# EAGLE design LPC_ERT_30_v3.51_RE (EAGLE 6.5.0)
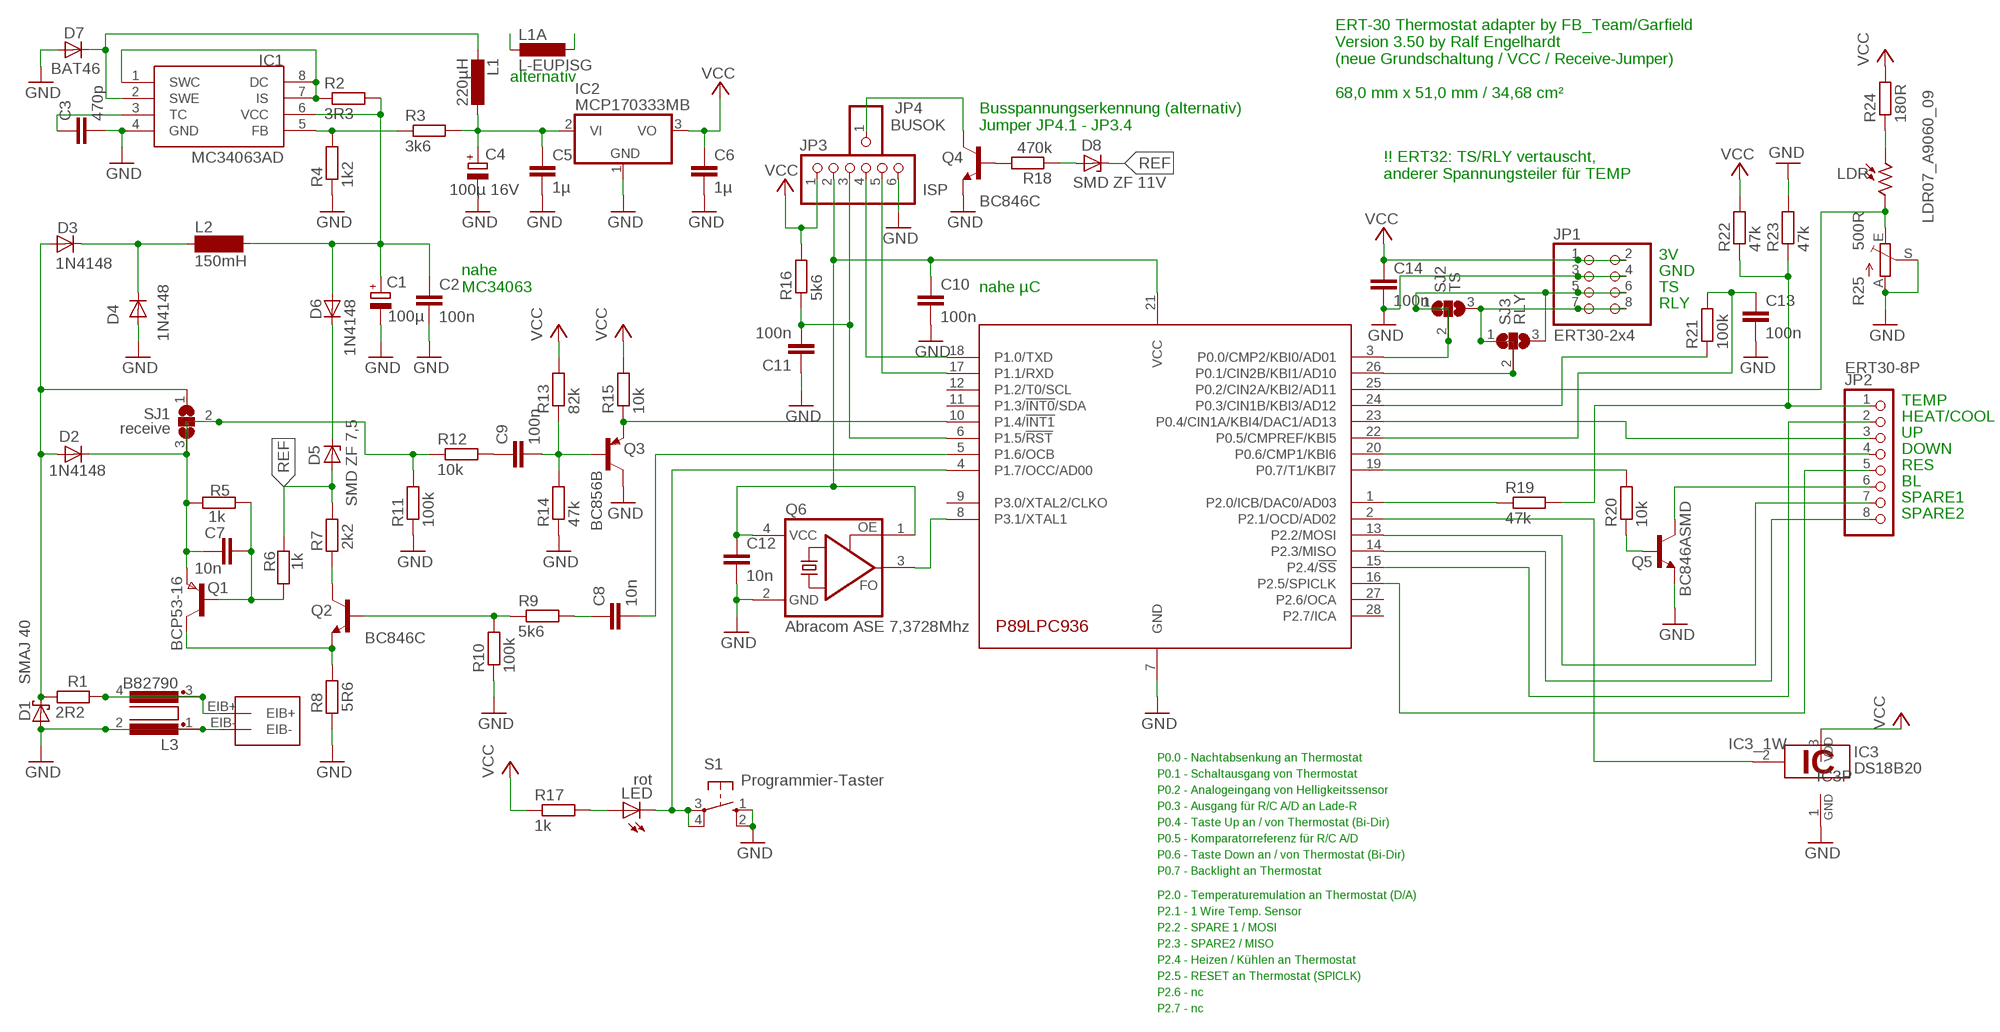
[diagram p0: schematic, sheet 1]

## Parts
C1  100µ  CPOL-EU153CLV-0605  [153CLV-0605]
C2  100n  C-EUC1206  [C1206]
C3  470p  C-EUC1206  [C1206]
C4  100µ 16V  CPOL-EU153CLV-0605  [153CLV-0605]
C5  1µ  C-EUC1206  [C1206]
C6  1µ  C-EUC1206  [C1206]
C7  10n  C-EUC1206  [C1206]
C8  10n  C-EUC1206  [C1206]
C9  100n  C-EUC1206  [C1206]
C10  100n  C-EUC1206  [C1206]
C11  100n  C-EUC1206  [C1206]
C12  10n  C-EUC1206  [C1206]
C13  100n  C-EUC1206  [C1206]
C14  100n  C-EUC1206  [C1206]
D1  SMAJ 40  MBRS130LT3  [SMB]
D2  1N4148  DIODE-MINIMELF  [MINIMELF]
D3  1N4148  DIODE-MINIMELF  [MINIMELF]
D4  1N4148  DIODE-MINIMELF  [MINIMELF]
D5  SMD ZF 7,5  ZENER-DIODESMD_ZF_XX  [MINIMELF]
D6  1N4148  DIODE-MINIMELF  [MINIMELF]
D7  BAT46  DIODE-MINIMELF  [MINIMELF]
D8  SMD ZF 11V  ZENER-DIODESMD_ZF_XX  [MINIMELF]
IC1  MC34063AD  [SOIC8]
IC2  MCP170333MB  [SOT89]
IC3  DS18B20  [TO92-]
JP1  ERT30-2x4  PINHD-2X4  [2X04]
JP2  ERT30-8P  PS-HEADER-8GERADE  [PS-G-8]
JP3  ISP  PINHD-1X6SELFBUS  [1X06_SELFBUS]
JP4  BUSOK  PINHD-1X1SELFBUS  [1X01_SELFBUS]
L1  220µH  L-EUPIS24XX  [PIS24XX]
L1A  L-EUPISG  [PISG]
L2  150mH  SD12-1000  [SD12_1000]
L3  B82790  [B82790]
LDR  LDR07_A9060_09  LDR07  [A90XX]
LED  rot  LEDCHIPLED_1206  [CHIPLED_1206]
LPC  P98LPC936 TSOP28  P89LPC936_SMDTSSOP28  [TSSOP28]
Q1  BCP53-16  PNPSOT223  [SOT223]
Q2  BC846C  BC846  [SOT23]
Q3  BC856B  BC856B-PNP-SOT23-BEC  [SOT23-BEC]
Q4  BC846C  BC846  [SOT23]
Q5  BC846ASMD  [SOT23]
Q6  Abracom ASE 7,3728Mhz  ASFASFL3  [ASFL3]
R1  2R2  R-EU_R1206  [R1206]
R2  3R3  R-EU_R1206  [R1206]
R3  3k6  R-EU_R1206  [R1206]
R4  1k2  R-EU_R1206  [R1206]
R5  1k  R-EU_R1206  [R1206]
R6  1k  R-EU_R1206  [R1206]
R7  2k2  R-EU_R1206  [R1206]
R8  5R6  R-EU_R1206  [R1206]
R9  5k6  R-EU_R1206  [R1206]
R10  100k  R-EU_R1206  [R1206]
R11  100k  R-EU_R1206  [R1206]
R12  10k  R-EU_R1206  [R1206]
R13  82k  R-EU_R1206  [R1206]
R14  47k  R-EU_R1206  [R1206]
R15  10k  R-EU_R1206  [R1206]
R16  5k6  R-EU_R1206  [R1206]
R17  1k  R-EU_R1206  [R1206]
R18  470k  R-EU_R1206  [R1206]
R19  47k  R-EU_R1206  [R1206]
R20  10k  R-EU_R1206  [R1206]
R21  100k  R-EU_R1206  [R1206]
R22  47k  R-EU_R1206  [R1206]
R23  47k  R-EU_R1206  [R1206]
R24  180R  R-EU_R1206  [R1206]
R25  500R  TRIM_EU-CA6H  [CA6H]
S1  Programmier-Taster  10-XX  [B3F-10XX]
SJ1  receive  SJ2W  [SJ_2]
SJ2  TS  SJ2W  [SJ_2]
SJ3  RLY  SJ2W  [SJ_2]
U$5  EIB-CON  [EIB-CON]

## Nets
+5V [supply]: C4.+ C5.1 IC2.2(VI) IC2.2@1(VI1) L1.2 L1A.2 R3.2
/RST: C11.2 JP3.3 LPC.6(P1.5/!RST) R16.1
AD0.3_TEMP: LPC.1(P2.0/ICB/DAC0/AD03) R19.1
AD11_LDR: LDR.P$2 LPC.25(P0.2/CIN2A/KBI2/AD11) R25.E
AD12: LPC.24(P0.3/CIN1B/KBI3/AD12) R21.1
BUS_OK: JP4.1 Q4.3(C)
CLK: LPC.8(P3.1/XTAL1) Q6.3(FO)
CMP_REF: C13.1 LPC.22(P0.5/CMPREF/KBI5) R21.2
EIB+ [supply]: D1.C D2.A D3.A R1.2 SJ1.1
GND [supply]: C1.- C2.2 C3.2 C4.- C5.2 C6.2 C10.2 C11.1 C12.2 C13.2 C14.2 D1.A D4.A D7.A IC1.4(GND) IC2.1(GND) IC3.1 JP1.3 JP1.4 JP3.6 L3.1 L3.2 LPC.7(GND) Q3.C Q4.2(E) Q5.2(E) Q6.2(GND) R4.1 R8.1 R10.1 R11.1 R14.1 R23.2 R25.A R25.S S1.1(S) S1.2(S1) U$5.EIB-
N$1 [supply]: C7.2 D2.C Q1.3(E) R5.2 R11.2 R12.1 SJ1.2 SJ1.3
N$2: C9.2 Q3.B R13.1 R14.2
N$4: Q4.1(B) R18.2
N$6 [supply]: Q2.3(C) R7.1
N$8 [supply]: D3.C D4.C L2.1
N$10: D8.A R18.1
N$12 [supply]: C7.1 Q1.1(B) R5.1 R6.2
N$14 [supply]: Q1.2(C) Q1.4(C) Q2.2(E) R8.2
N$18: C9.1 R12.2
N$20: Q5.1(B) R20.1
N$24: JP2.6 Q5.3(C)
N$31: Q2.1(B) R9.1 R10.2
N$32: LDR.P$1 R24.1
N$34: C8.1 R9.2
N$39: L3.3 L3.4 R1.1 U$5.EIB+
N$40: D5.C D6.C
N$41: LED.A R17.2
N$46: JP2.1 R19.2 R22.1 R23.1
P0.0_TS: JP1.5 JP1.6 LPC.3(P0.0/CMP2/KBI0/AD01) SJ2.1 SJ2.2 SJ3.3
P0.1_RLY: JP1.7 JP1.8 LPC.26(P0.1/CIN2B/KBI1/AD10) SJ2.3 SJ3.1 SJ3.2
P0.4_UP: JP2.3 LPC.23(P0.4/CIN1A/KBI4/DAC1/AD13)
P0.6_DOWN: JP2.4 LPC.20(P0.6/CMP1/KBI6)
P0.7_BL: LPC.19(P0.7/T1/KBI7) R20.2
P1.4_REC: LPC.10(P1.4/!INT1) Q3.E R15.1
P1.6_SENT: C8.2 LPC.5(P1.6/OCB)
P1.7_PROG: LED.C LPC.4(P1.7/OCC/AD00) S1.3(P) S1.4(P1)
P2.1_DS1820_1W1W: IC3.2 LPC.2(P2.1/OCD/AD02)
P2.2_SPARE1: JP2.7 LPC.13(P2.2/MOSI)
P2.3_SPARE2: JP2.8 LPC.14(P2.3/MISO)
P2.4_HEAT_COOL: JP2.2 LPC.15(P2.4/!SS)
P2.5_RST_ERT: JP2.5 LPC.16(P2.5/SPICLK)
Q6: C10.1 C12.1 JP3.2 LPC.21(VCC) Q6.1(OE) Q6.4(VCC)
REF: D5.A D8.C R6.1 R7.2
REF1.25V: IC1.5(FB) R3.1 R4.2
RXD: JP3.5 LPC.17(P1.1/RXD)
SWC_DC_IS: IC1.1(SWC) IC1.7(IS) IC1.8(DC) R2.1
SWE: D7.C IC1.2(SWE) L1.1 L1A.1
TC: C3.1 IC1.3(TC)
TXD: JP3.4 LPC.18(P1.0/TXD)
U_BUS [supply]: C1.+ C2.1 D6.A IC1.6(VCC) L2.2 R2.2
VCC [supply]: C6.1 C14.1 IC2.3(VO) IC3.3 JP1.1 JP1.2 JP3.1 R13.2 R15.2 R16.2 R17.1 R22.2 R24.2
Unconnected: LPC.9(P3.0/XTAL2/CLKO) LPC.11(P1.3/!INT0!/SDA) LPC.12(P1.2/T0/SCL) LPC.27(P2.6/OCA) LPC.28(P2.7/ICA)

## Notes on the sheet
- alternativ
- ERT-30 Thermostat adapter by FB_Team/Garfield
  Version 3.50 by Ralf Engelhardt 
  (neue Grundschaltung / VCC / Receive-Jumper)
  
  68,0 mm x 51,0 mm / 34,68 cm²
- Busspannungserkennung (alternativ)
  Jumper JP4.1 - JP3.4
- !! ERT32: TS/RLY vertauscht, 
  anderer Spannungsteiler für TEMP
- 3V
- GND
- nahe
  MC34063
- nahe µC | TS
- RLY
- TEMP
- HEAT/COOL
- UP
- DOWN
- RES
- BL
- SPARE1
- SPARE2
- P0.0 - Nachtabsenkung an Thermostat
- P0.1 - Schaltausgang von Thermostat
- P0.2 - Analogeingang von Helligkeitssensor
- P0.3 - Ausgang für R/C A/D an Lade-R
- P0.4 - Taste Up an / von Thermostat (Bi-Dir)
- P0.5 - Komparatorreferenz für R/C A/D
- P0.6 - Taste Down an / von Thermostat (Bi-Dir)
- P0.7 - Backlight an Thermostat
- P2.0 - Temperaturemulation an Thermostat (D/A)
- P2.1 - 1 Wire Temp. Sensor
- P2.2 - SPARE 1 / MOSI
- P2.3 - SPARE2 / MISO
- P2.4 - Heizen / Kühlen an Thermostat
- P2.5 - RESET an Thermostat (SPICLK)
- P2.6 - nc
- P2.7 - nc

## Library data of the parts
C1 C4 = rcl:CPOL-EU: POLARIZED CAPACITOR, European symbol
C2 C3 C5-C14 = rcl:C-EU: CAPACITOR, European symbol
D1 = diode:MBRS130LT3: Schottky Power Rectifier Source: http://www.onsemi.com/pub/Collateral/MBRS130LT3-D.PDF
D2-D4 D6 D7 = diode:DIODE-: DIODE
D5 D8 = diode:ZENER-DIODE: Z-Diode
IC1 = mc34063:MC34063
IC2 = linear:MCP1703*: 250 mA, 16V, Low Quiescent Current LDO Regulator Source: http://ww1.microchip.com/downloads/en/DeviceDoc/22049b.pdf
IC3 = 1wire:DS18B20: Programmable Resolution Digital Thermometer This chip provides a onewire thermosensor with approx. 0.5°C accuracy. A programmable over/undertemperure alarm is available. The precision can be set from 9..12 bits. Notes: Vdd must be applied for accurate measurements at low temperatures, as the parasite power circuit otherwise heats the sensor. If parasite power is used, Vdd has to be connected to GND. The DS1822 is a low-cost thermometer chip, the DS18S20 is similar to the DS18B20, but with 9 Bit precision only. Author: Jan Kandziora <jjj@gmx.de>
JP1 = pinhead:PINHD-2X4: PIN HEADER
JP2 = con-pss-pinhead:PS-HEADER-8: JAE-Electronics IL-G Series Connector IL-G-8P-S3T2 Reichelt PS 25/8G BR Digi-Key 670-2555-ND
JP3 = pinhead:PINHD-1X6: PIN HEADER
JP4 = pinhead:PINHD-1X1: PIN HEADER
L1 L1A = Inductor-Fastron:L-EU
L2 = inductor-neosid:SD12: INDUCTOR nominal inductance; OC_FARNELL: unknown; OC_NEWARK: unknown
L3 = Ralf1:B82790: Epcos B82790 Gleichtaktfilter 5µH (C502) - 4,7mH (C475)
LDR = photo-elements:LDR07: Photo Sensor LDR 03, LDR 05, LDR 07, A9060 xx, A9050 xx
LED = led:LED: LED OSRAM: - CHIPLED LG R971, LG N971, LY N971, LG Q971, LY Q971, LO R971, LY R971 LH N974, LH R974 LS Q976, LO Q976, LY Q976 LO Q996 - Hyper CHIPLED LW Q18S LB Q993, LB Q99A, LB R99A - SideLED LS A670, LO A670, LY A670, LG A670, LP A670 LB A673, LV A673, LT A673, LW A673 LH A674 LY A675 LS A676, LA A676, LO A676, LY A676, LW A676 LS A679, LY A679, LG A679 - Hyper Micro SIDELED® LS Y876, LA Y876, LO Y876, LY Y876 LT Y87S - SmartLED LW L88C, LW L88S LB L89C, LB L89S, LG L890 LS L89K, LO L89K, LY L89K LS L896, LA L896, LO L896, LY L896 - TOPLED LS T670, LO T670, LY T670, LG T670, LP T670 LSG T670, LSP T670, LSY T670, LOP T670, LYG T670 LG T671, LOG T671, LSG T671 LB T673, LV T673, LT T673, LW T673 LH T674 LS T676, LA T676, LO T676, LY T676, LB T676, LH T676, LSB T676, LW T676 LB T67C, LV T67C, LT T67C, LS T67K, LO T67K, LY T67K, LW E67C LS E67B, LA E67B, LO E67B, LY E67B, LB E67C, LV E67C, LT E67C LW T67C LS T679, LY T679, LG T679 LS T770, LO T770, LY T770, LG T770, LP T770 LB T773, LV T773, LT T773, LW T773 LH T774 LS E675, LA E675, LY E675, LS T675 LS T776, LA T776, LO T776, LY T776, LB T776 LHGB T686 LT T68C, LB T68C - Hyper Mini TOPLED® LB M676 - Mini TOPLED Santana® LG M470 LS M47K, LO M47K, LY M47K Source: http://www.osram.convergy.de LUXEON: - LUMILED® LXK2-PW12-R00, LXK2-PW12-S00, LXK2-PW14-U00, LXK2-PW14-V00 LXK2-PM12-R00, LXK2-PM12-S00, LXK2-PM14-U00 LXK2-PE12-Q00, LXK2-PE12-R00, LXK2-PE12-S00, LXK2-PE14-T00, LXK2-PE14-U00 LXK2-PB12-K00, LXK2-PB12-L00, LXK2-PB12-M00, LXK2-PB14-N00, LXK2-PB14-P00, LXK2-PB14-Q00 LXK2-PR12-L00, LXK2-PR12-M00, LXK2-PR14-Q00, LXK2-PR14-R00 LXK2-PD12-Q00, LXK2-PD12-R00, LXK2-PD12-S00 LXK2-PH12-R00, LXK2-PH12-S00 LXK2-PL12-P00, LXK2-PL12-Q00, LXK2-PL12-R00 Source: www.luxeon.com KINGBRIGHT: KA-3528ASYC Source: www.kingbright.com
LPC = P98LPC936_RE:P89LPC936_SMD
Q1 = zetex:PNPSOT223: PNP TRANSISTOR; MPN: DJT4030P-13; OC_FARNELL: 1710675; OC_NEWARK: 25R4489
Q2 Q4 = transistor-neu-to92:BC846: NPN TRANSISTOR
Q3 = transistor-neu-to92:*-PNP-: PNP Transistror
Q5 = transistor-npn:BC846*: NPN Transistor
Q6 = crystal:ASF*: CRYSTAL CLOCK OSCILLATORS 5.0 Vdc or 3.3 Vdc - LOW PROFILE ULTRA MINIATURE CERAMIC SURFACE MOUNT Source: http://www.abracon.com/Oscillators/asf1-L-L1.pdf
R1-R24 = rcl:R-EU_: RESISTOR, European symbol
R25 = pot:TRIM_EU-: POTENTIOMETER
S1 = switch-omron:10-XX: OMRON SWITCH; MPN: B3F-1000; OC_FARNELL: 176432; OC_NEWARK: 36M3542
SJ1-SJ3 = jumper:SJ2W: SMD solder JUMPER
U$5 = EIBdevices:EIB-CON

## Board
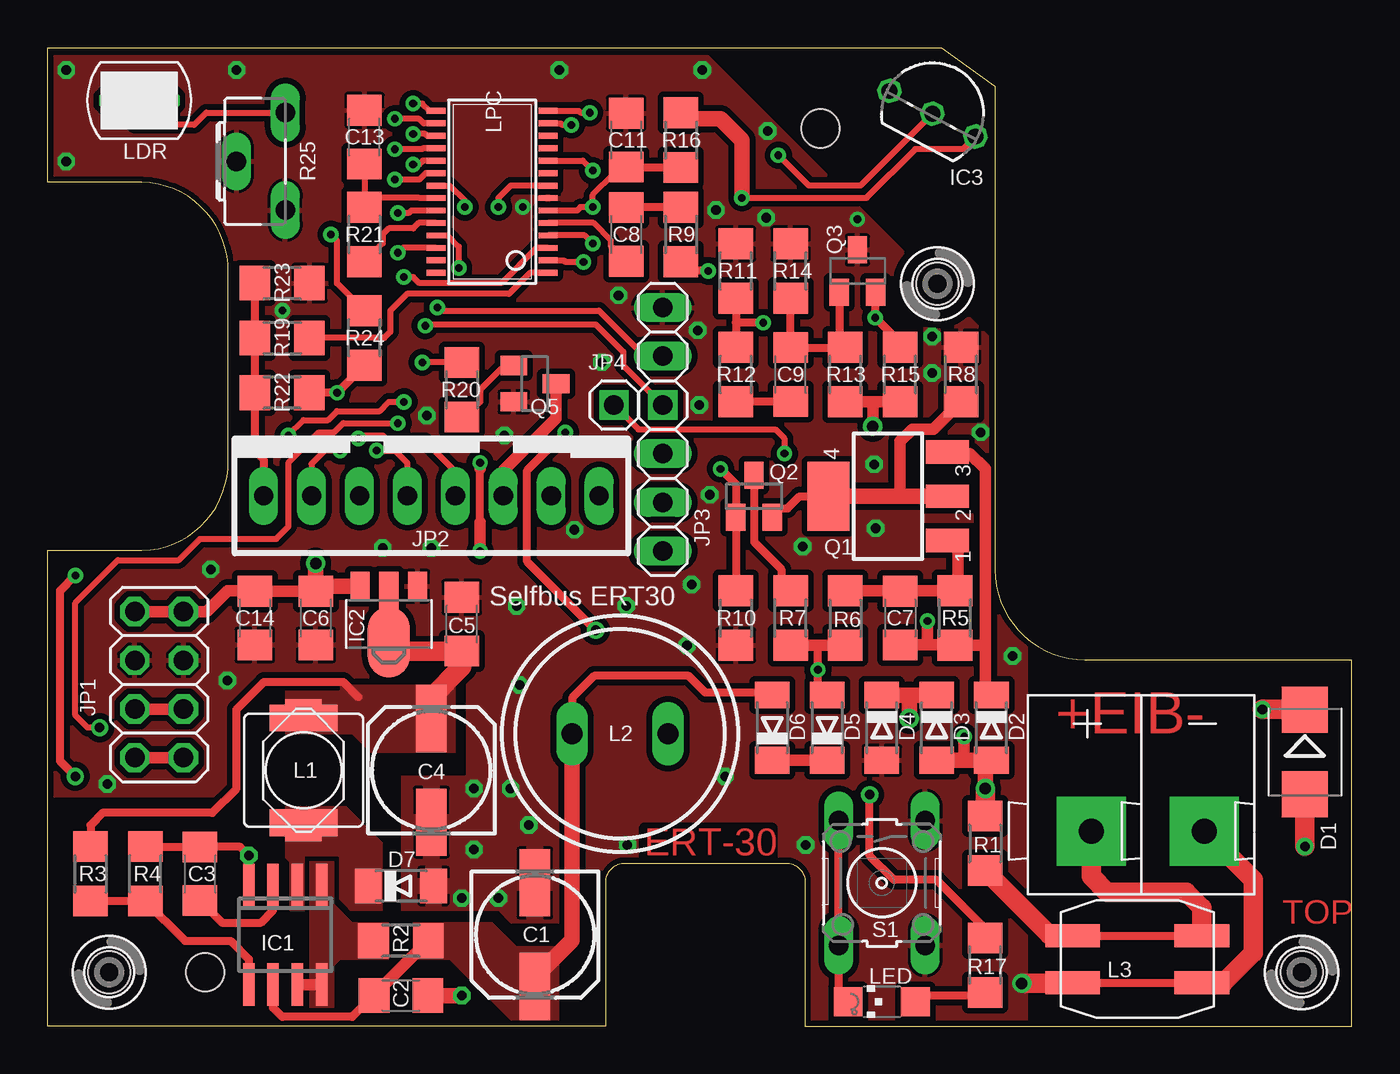
[diagram p1: board, top side]
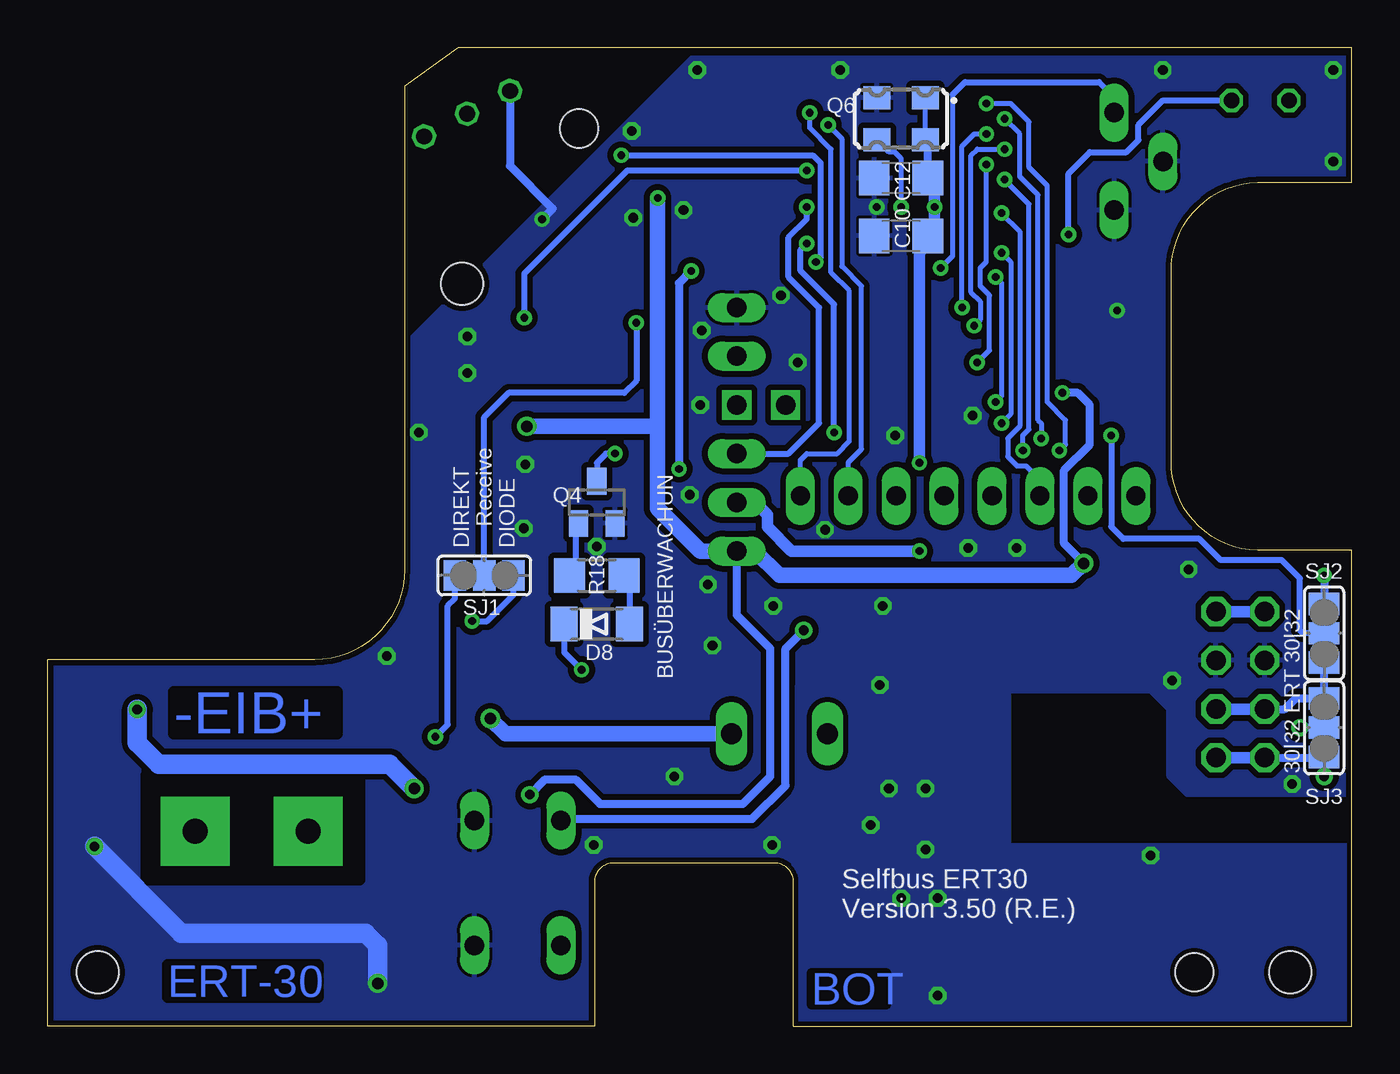
[diagram p2: board, bottom side, seen from below]

Size 68 x 51 mm. Coordinates in mm from the lower left corner, seen from the top.
Outline: 0,23.81 0,23.81
Outline: 29.1,0 29.1,7.5 arc-90 30.1,8.5 38.5,8.5 arc-90 39.5,7.5 39.5,0 68,0 68,19.1 54.1,19.1 arc-90 49.4,23.8 49.4,49 46.6,51 0,51 0,44 4.9,44 arc-90 9.4,39.3 9.4,29.5 arc-90 4.9,24.8 0,24.8 0,0 29.1,0
Copper layers (1*16): Top 0.035mm / dielectric 1.5mm / Bottom 0.035mm
Design rules "platinensammler_02 *": minimum track width 0.15mm, minimum drill 0.3mm, track to track 0.15mm, track to pad 0.15mm, pad to pad 0.15mm, via to via 0.15mm, smd to smd 0mil, copper to edge 0.2mm, drill to drill 0.2mm, minimum pad ring 0.2mm, minimum via ring 0.2mm, stop-mask expansion 4mil, vias tented up to drill 0.8mm, thermal gap 0.15mm
Holes 2 mm at 8.2,2.8 40.3,46.8
tRestrict: 4 lines
bRestrict: area 51.8,7.6 to 62.9,13.1; 5 lines

### Footprints (pad centres in the part's own frame; a part is rotated, then mirrored left to right if it is on the bottom)
153CLV-0605 = smd 3.5 x 1.6: + 2.7,0; - -2.7,0
C1206 = smd 1.6 x 1.8: 1 -1.4,0; 2 1.4,0
SMB = smd 2.4 x 2.4: A 2.2,0; C -2.2,0
MINIMELF = smd 1.4 x 1.8: A 1.7,0; C -1.7,0
SOIC8 = smd 0.6 x 2.2: 1 -1.905,-2.6; 2 -0.635,-2.6; 3 0.635,-2.6; 4 1.905,-2.6; 5 1.905,2.6; 6 0.635,2.6; 7 -0.635,2.6; 8 -1.905,2.6
SOT89 = smd 1 x 1.5: 1 -1.499,-1.981; 3 1.499,-1.981 | smd 1 x 2: 2 0,-1.727 | smd 2.2 x 3.7: 2@1 0,0.94
TO92- = drill 0.813 octagon: 1 -2.54,0; 2 0,0; 3 2.54,0
2X04 = drill 1.016 octagon: 1 -3.81,-1.27; 2 -3.81,1.27; 3 -1.27,-1.27; 4 -1.27,1.27; 5 1.27,-1.27; 6 1.27,1.27; 7 3.81,-1.27; 8 3.81,1.27
PS-G-8 = drill 1 long: 1 0.02,8.75; 2 0.02,6.25; 3 0.02,3.75; 4 0.02,1.25; 5 0.02,-1.25; 6 0.02,-3.75; 7 0.02,-6.25; 8 0.02,-8.75
1X06_SELFBUS = drill 1.016 long: 1 -6.35,0; 2 -3.81,0; 3 -1.27,0; 5 3.81,0; 6 6.35,0 | drill 1.016 square: 4 1.27,0
1X01_SELFBUS = drill 1.016 square: 1 0,0
PIS24XX = smd 1.4 x 1.9: 1 -3,0; 2 3,0
PISG = smd 1.4 x 3.56: 1 -2.73,0; 2 2.73,0
SD12_1000 = drill 1.1 long: 1 -2.5,0; 2 2.5,0
B82790 = smd 2.85 x 1.2: 1 -3.675,1.225; 2 3.062,1.225; 3 -3.675,-1.225; 4 3.062,-1.225
A90XX = drill 0.8 octagon: P$1 -1.5,0; P$2 1.5,0
CHIPLED_1206 = smd 1.5 x 1.5: A 0,-1.75; C 0,1.75
TSSOP28 = smd 0.305 x 0.991: 1 -4.225,-2.918; 2 -3.575,-2.918; 3 -2.925,-2.918; 4 -2.275,-2.918; 5 -1.625,-2.918; 6 -0.975,-2.918; 7 -0.325,-2.918; 8 0.325,-2.918; 9 0.975,-2.918; 10 1.625,-2.918; 11 2.275,-2.918; 12 2.925,-2.918; 13 3.575,-2.918; 14 4.225,-2.918; 15 4.225,2.918; 16 3.575,2.918; 17 2.925,2.918; 18 2.275,2.918; 19 1.625,2.918; 20 0.975,2.918; 21 0.325,2.918; 22 -0.325,2.918; 23 -0.975,2.918; 24 -1.625,2.918; 25 -2.275,2.918; 26 -2.925,2.918; 27 -3.575,2.918; 28 -4.225,2.918
SOT223 = smd 1.219 x 2.235: 1 -2.311,-3.099; 2 0,-3.099; 3 2.311,-3.099 | smd 3.6 x 2.2: 4 0,3.099
SOT23 = smd 1 x 1.4: 1 -0.95,-1.1; 2 0.95,-1.1; 3 0,1.1
SOT23-BEC = smd 1 x 1.4: B -0.95,-1.1; C 0,1.1; E 0.95,-1.1
ASFL3 = smd 1.4 x 1.2: 1 -1.27,-1.1; 2 1.27,-1.1; 3 1.27,1.1; 4 -1.27,1.1
R1206 = smd 1.6 x 1.803: 1 -1.422,0; 2 1.422,0
CA6H = drill 1.016 long: A -2.54,0; E 2.54,0; S 0,2.54
B3F-10XX = drill 1.016 long: 1 -3.251,2.261; 2 3.251,2.261; 3 -3.251,-2.261; 4 3.251,-2.261
SJ_2 = smd 1.168 x 1.6: 1 -1.524,0; 2 0,0; 3 1.524,0
2,2 = hole 2.2: 0,0
EIB-CON = drill 1.3 pad 3.6 square: EIB+ -5.9,0; EIB- 0,0

### Placement (x,y rotation side)
C1  25.4,4.76 270 top
C2  18.41,1.59 0 top
C3  7.94,7.94 90 top
C4  20,13.34 90 top
C5  21.59,20.95 90 top
C6  13.97,21.27 270 top
C7  44.45,21.27 270 top
C8  30.16,41.27 270 top
C9  38.73,33.97 90 top
C10  23.5,41.2 180 bottom
C11  30.16,46.2 270 top
C12  23.5,44.21 180 bottom
C13  16.51,46.35 90 top
C14  10.79,21.27 270 top
D1  65.56,14.29 270 top
D2  49.21,15.56 270 top
D3  46.35,15.56 270 top
D4  43.5,15.56 270 top
D5  40.64,15.56 90 top
D6  37.78,15.56 90 top
D7  18.41,7.3 0 top
D8  39.37,20.95 0 bottom
IC1  12.38,4.76 180 top
IC2  17.78,20.95 180 top
IC3  46.14,47.57 332 top
JP1  5.8,17.8 270 top
JP2  20,27.62 90 top
JP3  32.07,31.11 90 top
JP4  29.53,32.38 0 top
L1  13.34,13.34 90 top
L1A  13.34,13.34 90 top
L2  29.84,15.24 180 top
L3  56.52,3.49 180 top
LDR  4.76,48.26 180 top
LED  43.5,1.27 90 top
LPC  23.18,43.5 90 top
Q1  43.81,27.62 90 top
Q2  36.83,27.62 0 top
Q3  42.23,39.37 0 top
Q4  39.37,27.3 0 bottom
Q5  25.4,33.5 270 top
Q6  23.5,47.31 180 bottom
R1  48.9,9.53 90 top
R2  18.41,4.45 0 top
R3  2.22,7.94 90 top
R4  5.08,7.94 270 top
R5  47.31,21.27 270 top
R6  41.59,21.27 90 top
R7  38.73,21.27 270 top
R8  47.62,33.97 270 top
R9  33.02,41.27 90 top
R10  35.88,21.27 90 top
R11  35.88,39.37 270 top
R12  35.88,33.97 270 top
R13  41.59,33.97 270 top
R14  38.73,39.37 270 top
R15  44.45,33.97 270 top
R16  33.02,46.2 90 top
R17  48.9,3.17 270 top
R18  39.37,23.5 180 bottom
R19  12.22,35.88 180 top
R20  21.59,33.18 90 top
R21  16.51,41.27 90 top
R22  12.22,33.02 0 top
R23  12.22,38.73 0 top
R24  16.51,35.88 270 top
R25  12.38,45.09 90 top
S1  43.5,7.46 270 top
SJ1  45.24,23.5 0 bottom
SJ2  1.43,20.48 90 bottom
SJ3  1.43,15.56 90 bottom
U$2  [2,2]  65.4,2.8 0 top
U$5  60.33,10.16 0 top
U$9  [2,2]  46.4,38.7 0 top
U$10  [2,2]  3.2,2.8 0 top

### Tracks (layer width: path | path; a pad name or v marks a point on that pad's centre or on a via)
+5V
  Top 0.406: R3.2 2.22,10.48 2.86,11.11 8.57,11.11 9.84,12.38 9.84,16.51 11.27,17.94 15.4,17.94 16.19,17.14 | IC2.2 IC2.2@1
  Top 0.813: C4.+ 20,17.14 | 18.24,19.55 IC2.2@1
  Top 1.016: 20,17.14 21.59,18.73 C5.1 18.24,19.55
  pour Top (isolate 0.254, rank 2, no thermals): 21.27,17.78 15.24,17.78 15.24,17.46 12.38,17.46 12.38,15.24 15.88,15.24 16.83,14.29 21.27,14.29
/RST  (via drill 0.4)
  Top 0.254: 29.53,44.45 29.82,44.45 C11.2
  Top 0.305: LPC.6 27.6,42.52 27.78,42.7 v28.42,42.7 28.42,43.34 29.53,44.45
  Top 0.406: C11.2 30.18,44.77 R16.1
  Bottom 0.305: JP3.3 29.37,29.84 27.78,31.43 27.78,37.47 29.37,39.05 29.37,41.12 28.42,42.07 v28.42,42.7
AD0.3_TEMP
  Top 0.305: LPC.1 25.14,39.27 24.05,38.18 18.73,38.18 17.86,37.31 17.86,36.2 17.54,35.88 R19.1
AD11_LDR  (via drill 0.4)
  Top 0.305: LPC.25 20.85,41.22 21.43,40.64 v21.43,39.53 | R25.E 8.26,47.62 7.62,46.99 4.53,46.99 LDR.P$2
  Bottom 0.254: v21.43,39.53 20.8,40.16 20.8,48.58
  Bottom 0.305: 20.8,48.58 20.16,49.21 13.18,49.21 12.38,48.42 R25.E
AD12
  Top 0.305: R21.1 17.46,40.81 17.46,41.27 17.78,41.59 19.05,41.59 19.33,41.87 LPC.24
BUS_OK  (via drill 0.4)
  Top 0.305: JP4.1 30.8,31.11 37.94,31.11 38.42,30.64 v38.42,29.84
  Bottom 0.305: v38.42,29.84 38.89,29.84 39.37,29.37 Q4.3
CLK  (via drill 0.4)
  Top 0.305: LPC.8 24.14,43.82 23.5,43.18 v23.5,42.7
  Bottom 0.254: v23.5,42.7 23.5,45.24 23.81,45.56 24.13,45.56 24.73,46.16
  Bottom 0.406: 24.73,46.16 24.73,46.17 Q6.3
CMP_REF
  Top 0.254: 16.99,43.18 R21.2 | 19.38,43.17 19.37,43.18
  Top 0.305: C13.1 R21.2 | LPC.22 19.38,43.17 | 19.37,43.18 16.99,43.18
EIB+  (via drill 0.4, 0.5, 0.6)
  Top 0.61: v47.78,15.08 47.78,13.86
  Top 0.813: D3.A 47.78,13.86 D2.A 48.9,13.86 v48.9,12.38
  Top 1.016: D1.C 65.54,16.51 v63.34,16.51 | R1.2 v48.9,12.38
  Bottom 0.305: v47.78,15.08 47.15,15.72 47.15,21.91 46.77,22.29 SJ1.1
  Bottom 1.016: v63.34,16.51 63.34,14.76 62.23,13.65 50.16,13.65 v48.9,12.38
GND  (via drill 0.4, 0.5, 0.6)
  Top 0.406: L3.2 L3.1 | IC1.4 v10.48,8.89 10.03,9.34 C3.2 5.1,9.34 R4.1
  Top 0.813: C2.2 v21.59,1.59
  Top 1.016: D1.A | v65.56,9.37 D1.A | L3.1 61.32,2.27 62.87,3.81 62.87,7.62 U$5.EIB- | L3.2 53.41,2.22 v50.8,2.22
  Bottom 0.406: IC3.1 43.9,44.85 41.67,42.62 v42.23,42.07
  Bottom 1.016: v65.56,9.37 61.04,4.84 51.44,4.84 50.8,4.21 v50.8,2.22
  other vias: 22.23,12.38 22.23,9.21 21.59,6.67 24.13,12.38 23.5,6.67 25.08,10.48 12.22,37.31 24.77,42.7 35.32,13.02 33.34,19.84 24.61,17.78 30.23,9.45 30.16,21.91 24.45,21.91 8.49,23.81 9.37,18.02 3.1,12.62 17.46,24.92 20,24.92 27.46,25.88 33.58,23.02 43.18,25.96 43.1,29.29 34.53,27.7 33.97,32.38 28.89,34.61 19.76,31.83 23.81,30.8 29.77,38.1 33.89,36.27 34.85,42.55 37.47,42.15 37.54,46.67 34.13,49.85 26.67,49.85 9.84,49.85 0.95,49.85 0.95,45.09 39.53,9.45 39.37,25 50.32,19.29 46.12,34.05 46.12,35.96 48.66,30.96
  pour Bottom (isolate 0.305, rank 4): 0,12.06 8.57,12.06 9.53,13.02 9.53,16.51 10.48,17.46 29.21,17.46 29.21,8.26 39.37,8.26 39.37,0 68.6,0 68.6,19.1 54.4,19.1 49.4,24.1 49.4,35.5 34.4,50.5 0,50.5
  pour Top (isolate 0.305, rank 5): 0,12.06 9.21,12.06 9.84,12.7 9.84,16.67 11.43,18.26 21.91,18.26 21.91,9.21 23.5,8.26 39.37,8.26 39.37,0 51,0 51,22.46 49.4,24.1 49.4,35.5 34.4,50.5 0,50.5
  pour Top (isolate 0.254): 18.41,13.02 18.41,6.03 23.5,6.03 24.13,5.4 26.67,5.4 26.67,10.79 24.45,13.02
  pour Bottom (isolate 0.254, no thermals): 0,0 0,9.53 17.78,9.53 17.78,17.78 29.21,17.78 29.21,0
  pour Top (no thermals): 24.84,7.06 24.21,7.06 24.21,7.86 24.84,7.86
  pour Top (no thermals): 26.51,7.06 25.88,7.06 25.88,7.86 26.51,7.86
  pour Top (no thermals): 25.8,9.68 25.8,9.05 25,9.05 25,9.68
  pour Top (no thermals): 25.8,6.07 25.8,5.44 25,5.44 25,6.07
  pour Top (no thermals): 20.4,12.86 20.4,12.22 19.61,12.22 19.61,12.86
  pour Top (no thermals): 20.4,9.21 20.4,8.57 19.61,8.57 19.61,9.21
  pour Top (no thermals): 18.89,11.03 19.53,11.03 19.53,10.24 18.89,10.24
  pour Top (no thermals): 20.48,11.03 21.11,11.03 21.11,10.24 20.48,10.24
  pour Top (no thermals): 19.01,7.7 19.65,7.7 19.65,6.91 19.01,6.91
  pour Top (no thermals): 20.56,7.7 21.19,7.7 21.19,6.91 20.56,6.91
  pour Top (no thermals): 19.72,7.86 19.72,8.49 20.52,8.49 20.52,7.86
  pour Top (no thermals): 19.72,6.11 19.72,6.75 20.52,6.75 20.52,6.11
N$1  (via drill 0.4)
  Top 0.406: R11.2 35.88,36.67 | 35.88,36.67 R12.1 | v37.31,36.67 35.88,36.67
  Top 0.61: Q1.3 47,29.84 48.1,29.84 48.9,29.05 48.9,20 | 48.9,20 48.9,17.57 D2.C | C7.2 45.88,19.87 | 45.88,19.87 47.28,19.87 R5.2 48.74,19.85 48.9,20 | v45.88,21.11 45.88,19.87
  Bottom 0.305: v37.31,36.67 37.31,33.66 37.94,33.02 43.97,33.02 45.24,31.75 SJ1.2 SJ1.3 43.72,22.48 45.09,21.11 v45.88,21.11
N$2
  Top 0.406: R14.2 C9.2 41.57,35.37 R13.1 41.28,35.71 Q3.B
N$4
  Bottom 0.305: Q4.1 40.48,26.04 40.48,24.13 40.79,23.82 R18.2
N$6
  Top 0.406: Q2.3 36.83,25.24 38.26,23.81 38.26,23.02 38.58,22.7 R7.1
N$8  (via drill 0.6)
  Top 0.813: v44.93,16.03 44.93,17.26 | D4.C 44.93,17.26 | 44.93,17.26 D3.C
  Bottom 0.813: L2.1 44.13,15.24 v44.93,16.03
N$10
  Bottom 0.305: R18.1 37.67,23.22 D8.A
N$12
  Top 0.61: Q1.1 47.08,25.31 47.47,24.92 47.47,22.85 R5.1 44.47,22.7 C7.1 44.43,22.7 R6.2
N$14
  Top 0.406: Q2.2 38.24,26.99 38.58,26.99 39.21,27.62 Q1.4
  Top 0.61: R8.2 46.19,31.11 45.09,31.11 44.45,30.48 44.45,27.78 44.29,27.62
  Top 0.813: Q1.4 44.29,27.62 Q1.2
N$18
  Top 0.406: R12.2 35.9,32.57 C9.1
N$20
  Top 0.305: Q5.1 24.14,34.29 23.65,34.29 22.54,33.18 22.54,32.55 21.75,31.76 R20.1
N$24
  Top 0.61: JP2.6 23.75,28.95 26.5,31.7 Q5.3
N$31  (via drill 0.4)
  Top 0.406: R10.2 Q2.1 35.88,28.25 v35.08,29.05 | v34.45,39.37 33.5,39.37 R9.1
  Bottom 0.406: v34.45,39.37 35.08,38.73 v35.08,29.05
N$32  (via drill 0.4)
  Top 0.305: R24.1 15.08,38.73 15.08,40.96 v14.76,41.27
  Bottom 0.305: v14.76,41.27 14.76,44.45 13.65,45.56 11.75,45.56 11.11,46.2 11.11,46.99 9.84,48.26 LDR.P$1
N$34
  Top 0.406: R9.2 30.18,42.7 C8.1
N$39
  Top 0.406: L3.4 L3.3
  Top 1.016: U$5.EIB+ 54.42,7.8 55.24,6.99 59.37,6.99 60.19,6.17 L3.3 | L3.4 53.41,4.76 52.23,4.76 R1.1
N$40
  Top 0.61: D6.C D5.C
N$41
  Top 0.406: R17.2 48.73,1.59 45.56,1.59 LED.A
N$46
  Top 0.406: JP2.1 11.25,29.55 10.8,30 R22.1 R19.2 R23.1
P0.0_TS  (via drill 0.4)
  Top 0.305: LPC.3 25.49,40.57 23.65,38.73 19.37,38.73 19.05,39.05 v18.57,39.05 | v12.54,30.8 13.34,31.59 14.61,31.59 15.08,32.07 17.3,32.07 17.78,32.54 v18.57,32.54
  Top 0.61: JP1.5 JP1.6
  Bottom 0.254: v18.57,39.05 18.26,38.73 18.26,32.86 v18.57,32.54
  Bottom 0.305: v12.54,30.8 12.54,26.04 11.91,25.4 7.94,25.4 6.83,24.29 3.65,24.29 2.7,23.34 2.7,20.64 2.54,20.48 SJ2.2 SJ2.1
  Bottom 0.406: SJ2.1 SJ3.3 2.92,17.08 3.47,16.53 JP1.5
  Bottom 0.61: JP1.5 JP1.6
P0.1_RLY  (via drill 0.4, 0.5)
  Top 0.305: LPC.26 18.51,40.57 v18.26,40.32 | v18.26,31.43 15.4,31.43 14.92,30.96 14.13,30.96 12.54,29.37 12.54,26.04 11.91,25.4 7.94,25.4 6.83,24.29 3.65,24.29 1.43,22.07 1.43,16.19 2.06,15.56 v2.7,15.56
  Top 0.406: v1.43,13.02 0.64,13.81 0.64,22.7 v1.43,23.5
  Top 0.61: JP1.7 JP1.8
  Bottom 0.254: v18.26,40.32 17.78,39.85 17.78,31.91 v18.26,31.43
  Bottom 0.305: v1.43,13.02 SJ3.1 SJ3.2
  Bottom 0.406: v1.43,23.5 SJ2.3 | SJ3.2 v2.7,15.56 | JP1.7 1.47,13.99 SJ3.1
  Bottom 0.61: JP1.7 JP1.8
P0.4_UP  (via drill 0.4)
  Top 0.305: LPC.23 18.95,42.52 18.81,42.39 v18.26,42.39
  Bottom 0.254: v18.26,42.39 17.3,41.43 17.3,31.27 17.94,30.64 17.94,29.69 17.46,29.21 16.99,29.21 16.25,28.48 JP2.3
P0.6_DOWN  (via drill 0.4)
  Top 0.305: LPC.20 19.71,44.47 19.37,44.13 v18.1,44.13 | v17.14,30 18.1,30 18.75,29.35 JP2.4
  Bottom 0.254: v17.14,30 17.14,30.8 16.83,31.11 16.83,42.86 v18.1,44.13
P0.7_BL  (via drill 0.4)
  Top 0.305: LPC.19 19.56,45.12 19.37,44.93 v19.05,44.93 | R20.2 v19.53,34.6
  Bottom 0.254: v19.05,44.93 19.05,39.85 19.37,39.53 19.37,38.58 18.89,38.1 18.89,35.24 v19.53,34.6
P1.4_REC  (via drill 0.4)
  Top 0.305: LPC.10 27.9,45.12 v28.42,44.61
  Top 0.406: R15.1 44.3,35.4 43.97,35.72 43.97,36.11 v43.16,36.93 43.16,38.25 Q3.E
  Bottom 0.305: v28.42,44.61 37.78,44.61 43.16,39.23 v43.16,36.93
P1.6_SENT
  Top 0.305: C8.2 29.37,40.67 29.37,40.96 28.45,41.87 LPC.5
P1.7_PROG  (via drill 0.4, 0.5)
  Top 0.305: v28.42,40.8 27.99,41.22 LPC.4
  Top 0.406: S1.3 S1.4 41.24,1.78 LED.C | v28.57,20.64 25,24.21 25,28.97 v26.99,30.96
  Bottom 0.305: v26.99,30.96 26.99,37.62 28.73,39.37 28.73,40.48 v28.42,40.8
  Bottom 0.406: v28.57,20.64 29.53,19.68 29.53,12.54 31.27,10.79 41.15,10.79 S1.3
P2.1_DS1820_1W1W  (via drill 0.4)
  Top 0.305: v38.1,45.4 39.69,43.81 42.38,43.81 IC3.2 | LPC.2 26.91,39.92 26.99,39.85 v27.94,39.85
  Bottom 0.305: v38.1,45.4 28.1,45.4 27.7,45.01 27.7,40.08 v27.94,39.85
P2.2_SPARE1  (via drill 0.4)
  Top 0.305: LPC.13 26.75,47.07 26.83,46.99 v27.3,46.99
  Bottom 0.254: JP2.7 26.25,29.39 25.56,30.08 25.56,38.58 26.59,39.61 26.59,46.28 v27.3,46.99
P2.3_SPARE2  (via drill 0.4)
  Top 0.305: LPC.14 27.68,47.72 27.78,47.62 v28.26,47.62
  Bottom 0.254: JP2.8 28.75,29.51 28.42,29.84 26.83,29.84 26.19,30.48 26.19,38.34 27.15,39.29 27.15,45.72 28.26,46.83 v28.26,47.62
P2.4_HEAT_COOL  (via drill 0.4)
  Top 0.305: LPC.15 19.91,47.72 19.53,48.1 v19.05,48.1 | v15.24,30 14.45,30 13.75,29.31 JP2.2
  Bottom 0.254: v15.24,30 14.92,30.32 14.92,31.59 15.88,32.54 15.88,43.81 16.83,44.77 16.83,47.15 17.78,48.1 v19.05,48.1
P2.5_RST_ERT  (via drill 0.4)
  Top 0.254: v16.19,30.64 16.35,30.8
  Top 0.305: LPC.16 19.6,47.07 19.37,47.31 v18.1,47.31 | 16.35,30.8 17.46,30.8 17.78,30.48 19.68,30.48 21.25,28.91 JP2.5
  Bottom 0.254: v18.1,47.31 17.3,46.51 17.3,44.29 16.35,43.34 16.35,31.59 16.19,31.43 v16.19,30.64
Q6  (via drill 0.4)
  Top 0.305: LPC.21 20.95,43.82 21.75,43.02 v21.75,42.7
  Top 0.406: 22.54,26.27 22.54,29.05
  Top 0.61: v22.54,24.77 22.54,26.27 | 22.54,29.05 v22.54,29.37
  Bottom 0.254: Q6.4 Q6.1
  Bottom 0.406: C12.1 22.09,46.08 Q6.4
  Bottom 0.61: JP3.2 31.11,27.3 30.48,26.67 30.48,26.04 29.21,24.77 v22.54,24.77 | v22.54,29.37 22.54,40.35 22.09,40.8 C10.1 21.75,41.54 v21.75,42.7 21.75,43.87 C12.1
REF  (via drill 0.4)
  Top 0.406: D5.A 40.16,17.73 v40.16,18.57 40.16,19.85
  Top 0.61: R6.1 40.16,19.85 R7.2 38.26,19.37
  Bottom 0.305: D8.C 41.07,19.48 v40.16,18.57
REF1.25V
  Top 0.406: IC1.5 10.48,3.49 9.53,4.45 7.15,4.45 R4.2 R3.1
RXD  (via drill 0.4)
  Top 0.305: LPC.17 19.78,46.42 19.68,46.51 v19.05,46.51 | v20.32,37.47 20.48,37.31 28.73,37.31 31.11,34.92 JP3.5
  Bottom 0.254: v20.32,37.47 20.32,45.88 19.68,46.51 v19.05,46.51
SWC_DC_IS
  Top 0.61: IC1.7 IC1.8
  pour Top (isolate 0.254, no thermals): 13.65,8.57 13.65,0.95 14.92,0.95 14.92,3.17 15.24,3.49 17.78,3.49 17.78,5.4 15.88,5.4 14.92,6.35 14.92,8.57
SWE
  pour Top (isolate 0.254, rank 2, no thermals): 12.38,11.43 12.38,8.81 12.62,8.57 12.62,6.03 13.65,6.03 13.65,8.57 14.92,8.57 14.92,6.35 15.24,6.03 17.46,6.03 17.46,9.53 15.56,11.43
TC
  Top 0.406: C3.1 9.08,5.4 11.11,5.4 11.75,6.03 IC1.3
TXD  (via drill 0.4)
  Top 0.305: LPC.18 19.58,45.77 19.53,45.72 v18.1,45.72 | v19.68,36.51 19.76,36.59 28.57,36.59 30,35.16 30,34.45 JP3.4
  Bottom 0.254: v18.1,45.72 19.53,45.72 19.84,45.4 19.84,38.26 19.37,37.78 19.37,36.83 v19.68,36.51
U_BUS
  Top 0.406: C2.1 17.02,1.62 15.87,0.48 12.22,0.48 11.75,0.95 IC1.6 | D6.A 37.66,17.38 34.29,17.38 33.42,18.26 28.5,18.26 27.34,17.11 L2.2
  Top 0.61: R2.2 17.02,1.62
  Top 0.813: L2.2 27.34,4.49 25.4,2.54 C1.+
  pour Top (isolate 0.254, rank 3, no thermals): 19.05,5.4 19.05,3.49 20.95,3.49 24.13,0.32 26.67,0.32 26.67,4.13 24.45,4.13 23.18,5.4
VCC  (via drill 0.4, 0.5, 0.6)
  Top 0.305: v36.2,43.18 42.7,43.18 45.24,45.72 47.72,45.72 IC3.3
  Top 0.406: R17.1 48.9,5.08 46.35,7.62 44.13,7.62 42.86,8.89 v42.86,12.06 | R24.2 16.51,34.45 v15.08,33.02 R22.2
  Top 0.61: JP1.1 JP1.2 8.28,21.61 9.37,22.7 10.77,22.7 C14.1 C6.1 | R13.2 43.02,32.55 | 43.02,32.55 R15.2 | v43.02,31.27 43.02,32.55
  Top 0.813: IC2.3 14.23,22.94 C6.1 v13.97,24.13 | R16.2 33.33,47.31 35.08,47.31 36.2,46.2 v36.2,43.18
  Bottom 0.406: v42.86,12.06 42.07,12.86 40.48,12.86 39.21,11.59 31.75,11.59 30.32,13.02 30.32,19.68 32.07,21.43 JP3.1 | v13.97,24.13 15,25.16 15,28.97 13.65,30.32 13.65,32.38 14.29,33.02 v15.08,33.02
  Bottom 0.61: JP1.1 JP1.2
  Bottom 0.813: v13.97,24.13 14.61,23.5 29.84,23.5 31.11,24.77 JP3.1 33.97,24.77 36.2,26.99 36.2,31.27 | 36.2,31.27 v43.02,31.27 | 36.2,31.27 v36.2,43.18

### Text on the board
Top: +EIB- | ERT-30 | TOP
Bottom: -EIB+ | ERT-30 | BOT
tNames: Selfbus ERT30
bNames: Receive | DIODE | DIREKT | BUSÜBERWACHUN | 30|32 ERT 30|32 | Selfbus ERT30 / Version 3.50 (R.E.)